# EasyEDA schematic schematic.json
TITLE: Pocket Play; REV: 1.0; Date: 2025-04-30; Sheet: 1/1; Drawn By: Nico Brooks; Company: Nico Brooks
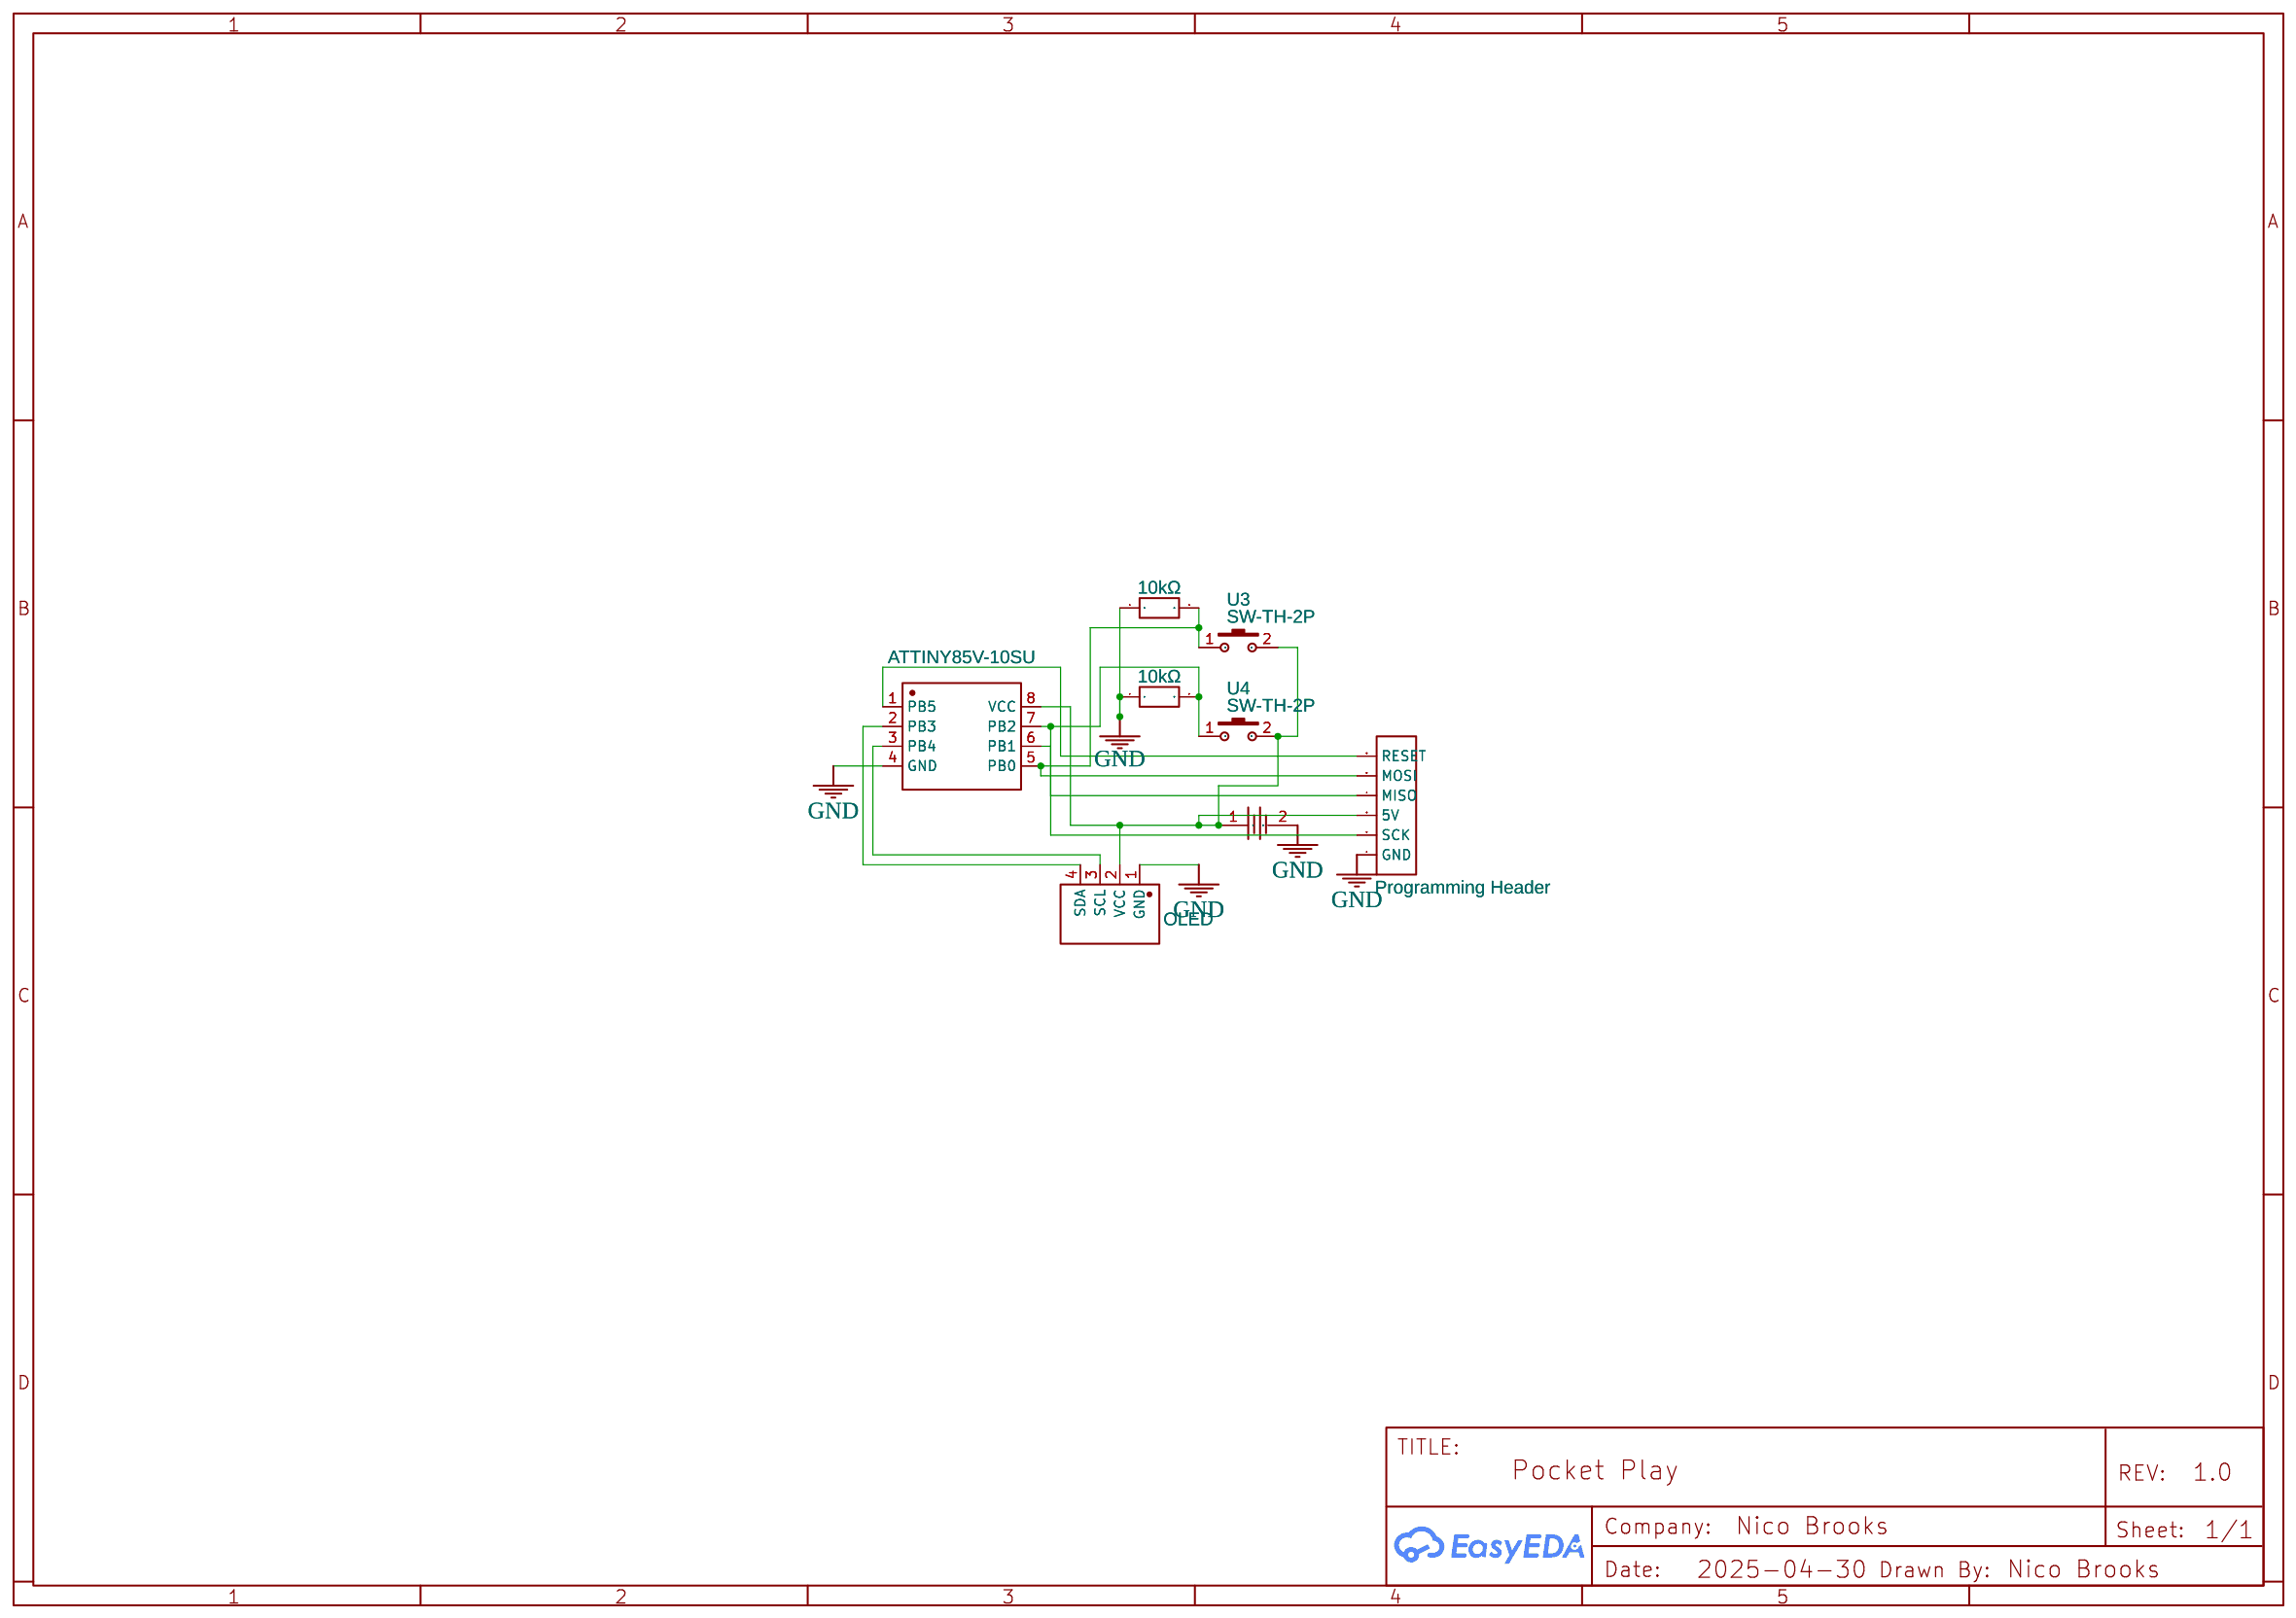
[diagram p0: schematic sheet]

## Parts
B1  CR2032  [BAT-TH_CR2032-BS-6-1]
J1  Programming Header  [HDR-M-2.54_1X6]
OLED1  OLED  [OLED-TH_4P-P2.54-L27.8-W27.3]
U1  10kΩ  [RES-TH_BD2.7-L6.2-P10.20-D0.4]
U2  10kΩ  [RES-TH_BD2.7-L6.2-P10.20-D0.4]
U3  SW-TH-2P  [SW-TH-2P]
U4  SW-TH-2P  [SW-TH-2P]
U6  ATTINY85V-10SU  [SOIC-8_L5.3-W5.3-P1.27-LS8.0-BL]

## Library data of the parts
B1 = CR2032-BS-6-1: Supplier: LCSC; Manufacturer: Q&J; Supplier Part: C70377; JLCPCB Part Class: Extended Part
J1 = HEADER_6
OLED1 = UN-2864KMBEG01: Supplier: LCSC; Supplier Part: C9900067968; Manufacturer: null; Contributor: lcsc
U1 U2 = CR1/4W-10K±5%-OT26: Contributor: lcsc; Supplier: LCSC; Supplier Part: C2894537; Manufacturer: VO(翔胜); JLCPCB Part Class: Extended Part
U3 U4 = SW-TH-2P: Contributor: rstmsvk
U6 = ATTINY85V-10SU: Contributor: LCSC; Supplier: LCSC; Supplier Part: C152192; Manufacturer: MICROCHIP(美国微芯); JLCPCB Part Class: Extended Part

## Nets
GND: B1.2 J1.1(GND) OLED1.1(GND) U1.1 U2.1 U6.4(GND)
Net-(B1-1): B1.1 J1.3(5V) OLED1.2(VCC) U3.2 U4.2 U6.8(VCC)
Net-(J1-2): J1.2(SCK) U2.2 U4.1 U6.7(PB2)
Net-(J1-4): J1.4(MISO) U6.6(PB1)
Net-(J1-5): J1.5(MOSI) U1.2 U3.1 U6.5(PB0)
Net-(J1-6): J1.6(RESET) U6.1(PB5)
Net-(OLED1-3): OLED1.3(SCL) U6.3(PB4)
Net-(OLED1-4): OLED1.4(SDA) U6.2(PB3)
